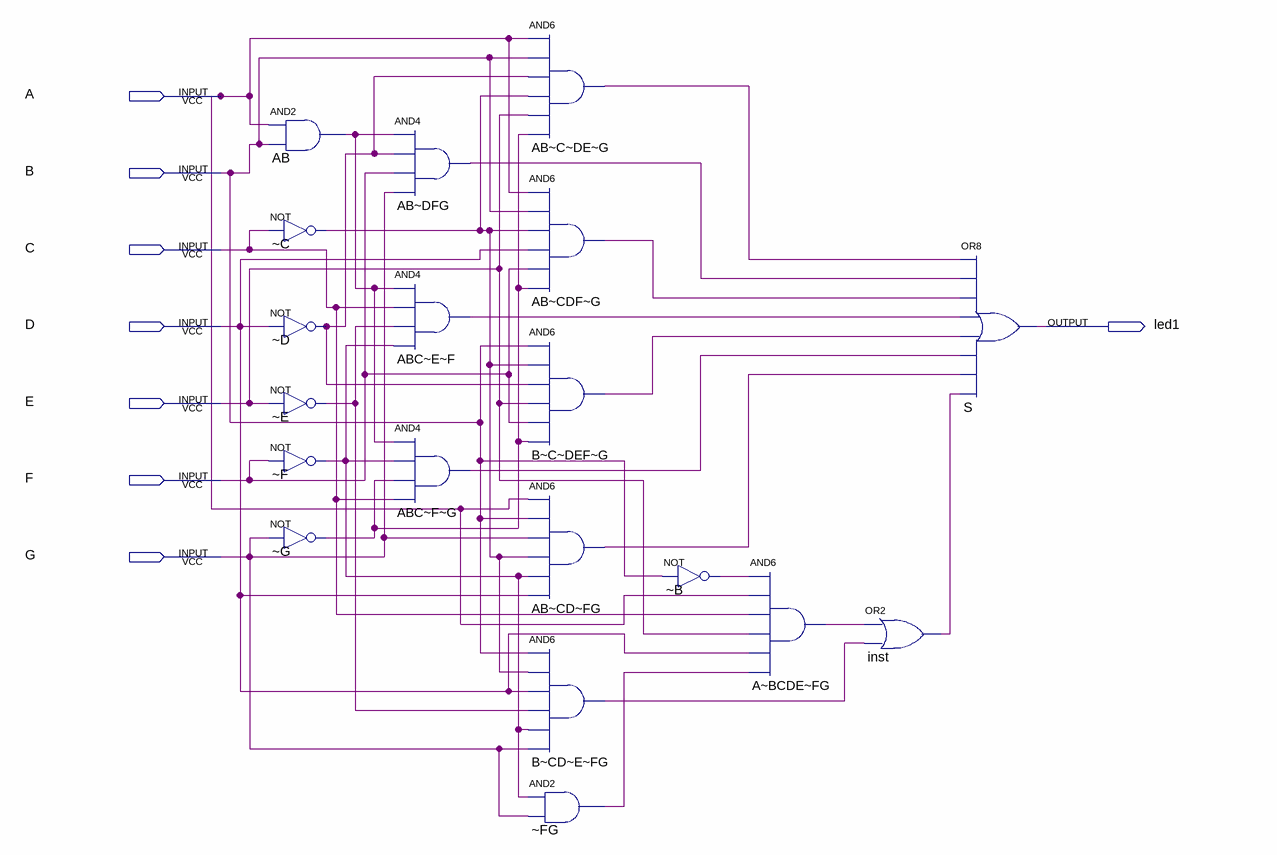
[diagram p0: schematic sheet]
// Quartus schematic led12.bdf as structural Verilog: 19 symbols, 8 pins
module led12 (
  input  A,
  input  B,
  input  C,
  input  D,
  input  E,
  input  F,
  input  G,
  output led1
);

  wire _B_out, _C_out, _D_out, _E_out, _F_out, _FG_out, _G_out, A_BCDE_FG_out, AB_C_DE_G_out, AB_CD_FG_out,
       AB_CDF_G_out, AB_DFG_out, AB_out, ABC_E_F_out, ABC_F_G_out, B_C_DEF_G_out, B_CD_E_FG_out, inst_out;

  and AB (AB_out, A, B);
  not \u_~C  (_C_out, C);
  not \u_~D  (_D_out, D);
  not \u_~E  (_E_out, E);
  not \u_~F  (_F_out, F);
  not \u_~G  (_G_out, G);
  and \AB~DFG  (AB_DFG_out, AB_out, _D_out, F, G);
  and \ABC~E~F  (ABC_E_F_out, AB_out, C, _E_out, _F_out);
  and \ABC~F~G  (ABC_F_G_out, AB_out, _F_out, _G_out, C);
  and \AB~C~DE~G  (AB_C_DE_G_out, A, B, _D_out, _C_out, E, _G_out);
  and \AB~CDF~G  (AB_CDF_G_out, A, B, _C_out, D, F, _G_out);
  and \B~C~DEF~G  (B_C_DEF_G_out, B, _C_out, _D_out, E, F, _G_out);
  and \AB~CD~FG  (AB_CD_FG_out, A, B, G, _C_out, _F_out, D);
  and \B~CD~E~FG  (B_CD_E_FG_out, B, _C_out, D, _E_out, _F_out, G);
  and \u_~FG  (_FG_out, _F_out, G);
  not \u_~B  (_B_out, B);
  and \A~BCDE~FG  (A_BCDE_FG_out, _B_out, A, C, E, D, _FG_out);
  or inst (inst_out, A_BCDE_FG_out, B_CD_E_FG_out);
  or S (led1, AB_C_DE_G_out, AB_DFG_out, AB_CDF_G_out, ABC_E_F_out, B_C_DEF_G_out, ABC_F_G_out, AB_CD_FG_out, inst_out);
endmodule
